# Altium schematic sheet BLOCK DIAGRAM.SchDoc
size A4; Author: Induja/Karthik; SheetNumber: 1; SheetTotal: 7
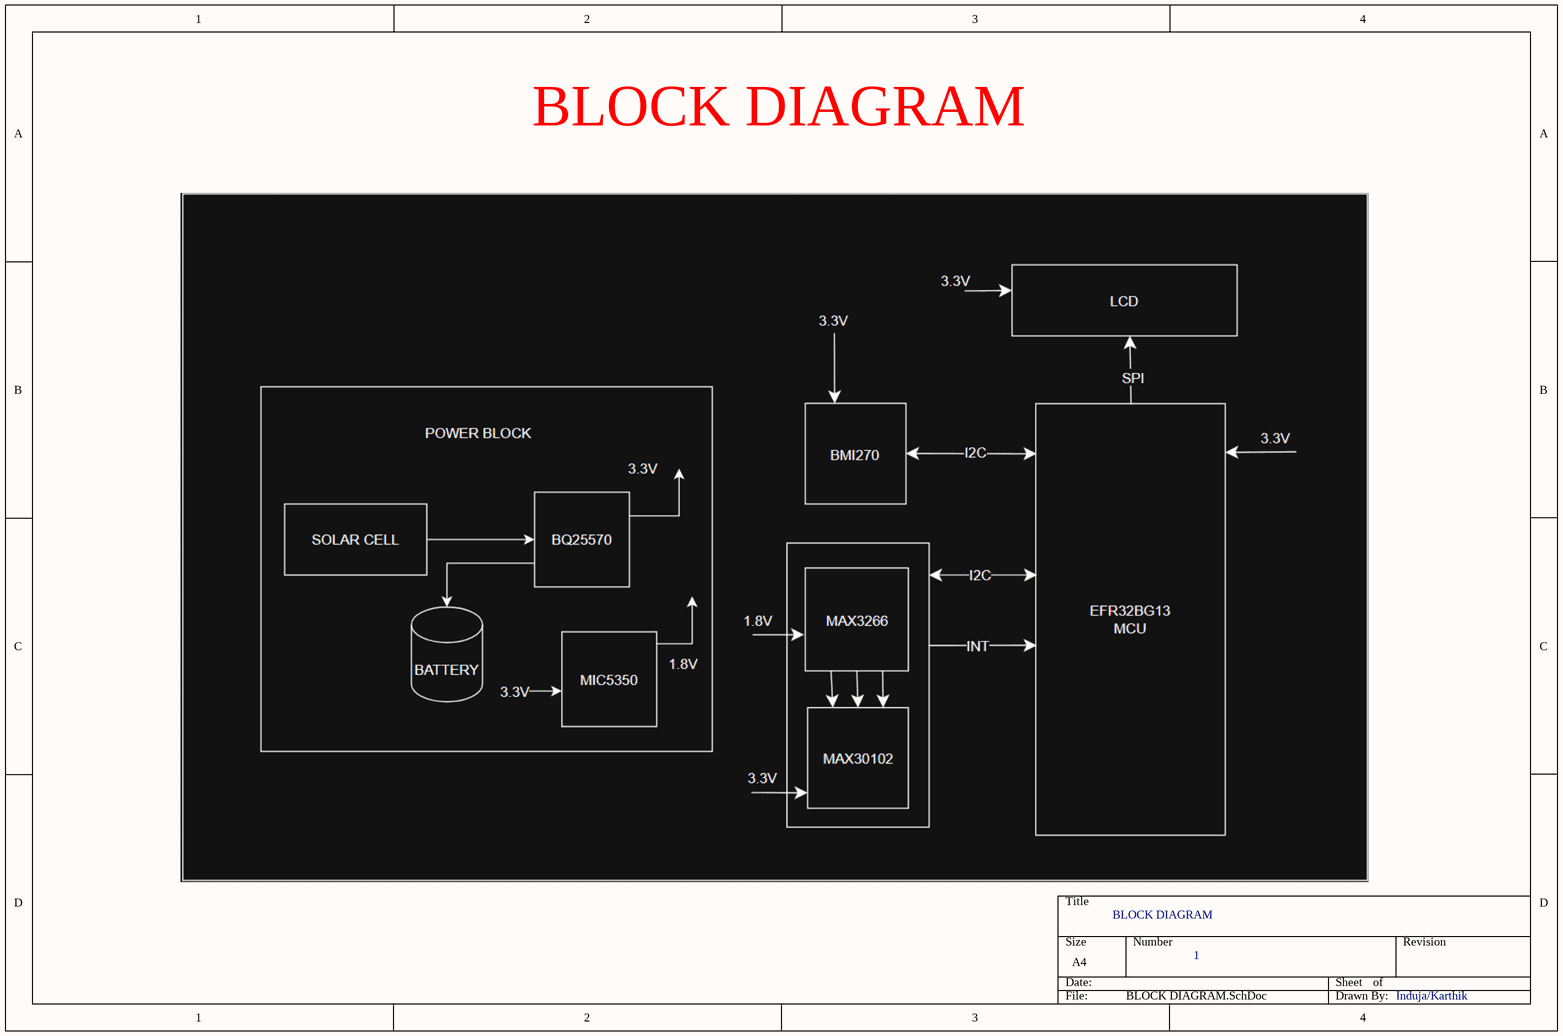
[diagram p0: BLOCK DIAGRAM.SchDoc]

## Notes on the sheet
- BLOCK DIAGRAM